# Altium schematic sheet Sheet1.SchDoc
size A4; DocumentNumber: 1; SheetNumber: 1; SheetTotal: 1
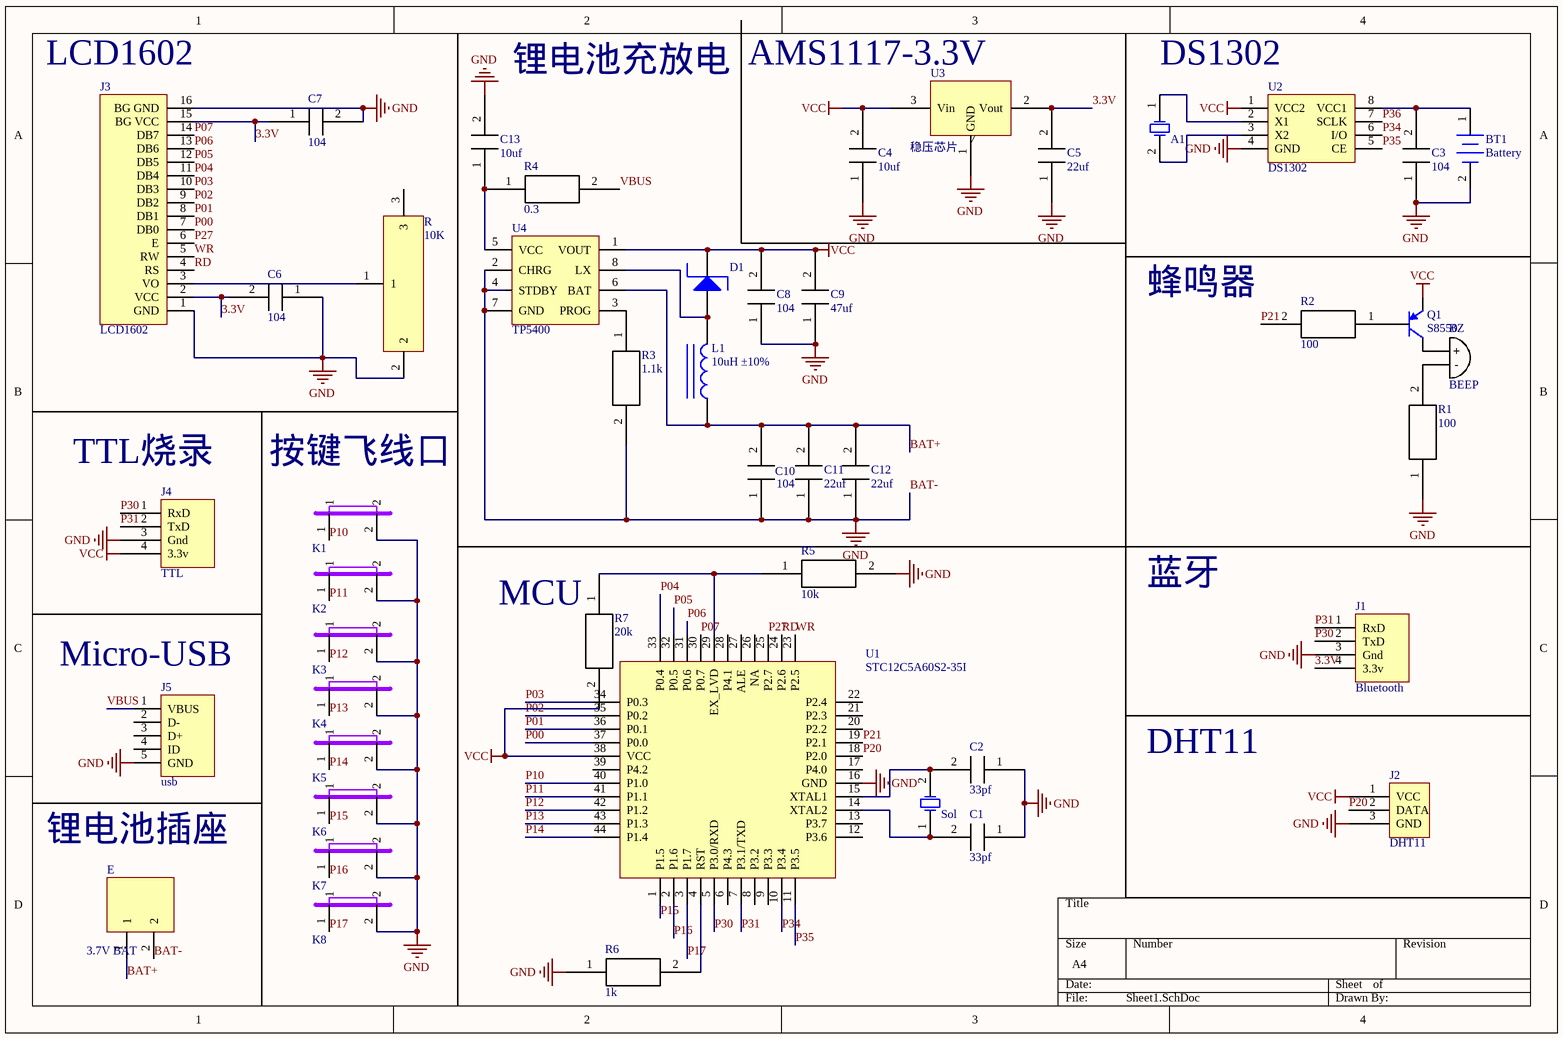
[diagram p0: Sheet1.SchDoc]

## Parts
A1  CrystalOscillator  [3*8圆柱晶振]  (value not drawn)
BT1  Battery  [CR1220_A]
BZ  BEEP  [BEEP 6.6x12x8.5]
C1  33pf  [C 0805_M]
C2  33pf  [C 0805_M]
C3  104  [C 0805_M]
C4  10uf  [C 0805_M]
C5  22uf  [C 0805_M]
C6  104  [C 0805_M]
C7  104  [C 0805_M]
C8  104  [C 0805_M]
C9  47uf  [C 0805_M]
C10  104  [C 0805_M]
C11  22uf  [C 0805_M]
C12  22uf  [C 0805_M]
C13  10uf  [C 0805_M]
D1  B5819W  SL  [SMB]  (value not drawn)
E  3.7V BAT  [XH2.54-LI-2P]
J1  Bluetooth  [HDR2.54-M-LI-4P]
J2  DHT11  [HDR2.54-M-LI-3P]
J3  LCD1602  [LCD-1602]
J4  TTL  [HDR2.54-LI-4P]
J5  usb  [USB-micro_C]
K1  key  [飞线口]  (value not drawn)
K2  key  [飞线口]  (value not drawn)
K3  key  [飞线口]  (value not drawn)
K4  key  [飞线口]  (value not drawn)
K5  key  [飞线口]  (value not drawn)
K6  key  [飞线口]  (value not drawn)
K7  key  [飞线口]  (value not drawn)
K8  key  [飞线口]  (value not drawn)
L1  10uH ±10%  [0805_L]
Q1  S8550  [SOT23]
R  10K  [可变电阻]
R1  100  [0805R]
R2  100  [0805R]
R3  1.1k  [0805R]
R4  0.3  [0805R]
R5  10k  [0805R]
R6  1k  [0805R]
R7  20k  [0805R]
Sol  CrystalOscillator  [OSC HC-49S]  (value not drawn)
U1  STC12C5A60S2-35I  [LQFP44-10*10]
U2  DS1302  [DIP8]
U3  稳压芯片  [SOT-223]
U4  TP5400  [SOP8]

## Nets
BAT-: BT1.2(-) C1.1 C2.1 C3.1 C4.1 C5.1 C6.1 C7.2 C8.1 C9.1 C10.1 C11.1 C12.1 C13.2 E.2 J1.3(Gnd) J2.3(GND) J3.1(GND) J3.16(BG_GND) J4.3(Gnd) J5.5(GND) K1.2 K2.2 K3.2 K4.2 K5.2 K6.2 K7.2 K8.2 R.2 R1.1 R3.2 R5.2 R6.1 U1.16(GND) U2.4(GND) U3.1(GND) U4.2(CHRG) U4.4(STDBY) U4.7(GND)  [also labelled GND]
VCC: C4.2 C8.2 C9.2 D1.2(K) J2.1(VCC) J4.4(3.3v) Q1.2(E) R7.2 U1.38(VCC) U2.1(VCC2) U3.3(Vin) U4.1(VOUT)
3.3V: C5.2 C6.2 C7.1 J1.4(3.3v) J3.2(VCC) J3.15(BG_VCC) U3.2(Vout)
BAT+: C10.2 C11.2 C12.2 E.1 L1.1 U4.6(BAT)
P00: J3.7(DB0) U1.37(P0.0)
P01: J3.8(DB1) U1.36(P0.1)
P02: J3.9(DB2) U1.35(P0.2)
P03: J3.10(DB3) U1.34(P0.3)
P04: J3.11(DB4) U1.33(P0.4)
P05: J3.12(DB5) U1.32(P0.5)
P06: J3.13(DB6) U1.31(P0.6)
P07: J3.14(DB7) U1.30(P0.7)
P10: K1.1 U1.40(P1.0)
P11: K2.1 U1.41(P1.1)
P12: K3.1 U1.42(P1.2)
P13: K4.1 U1.43(P1.3)
P14: K5.1 U1.44(P1.4)
P15: K6.1 U1.1(P1.5)
P16: K7.1 U1.2(P1.6)
P17: K8.1 U1.3(P1.7)
P20: J2.2(DATA) U1.18(P2.0)
P21: R2.2 U1.19(P2.1)
P27: J3.6(E) U1.25(P2.7)
P30: J1.2(TxD) J4.1(RxD) U1.5(P3.0/RXD)
P31: J1.1(RxD) J4.2(TxD) U1.7(P3.1/TXD)
P34: U1.10(P3.4) U2.6(I/O)
P35: U1.11(P3.5) U2.5(CE)
P36: U2.7(SCLK)
RD: J3.4(RS) U1.24(P2.6)
VBUS: J5.1(VBUS) R4.2
WR: J3.5(RW) U1.23(P2.5)
NetA1_1: A1.1(OSC1) U2.2(X1)
NetA1_2: A1.2(OSC2) U2.3(X2)
NetBT1_1: BT1.1(+) C3.2 U2.8(VCC1)
NetBZ_1: BZ.1(+) Q1.3(C)
NetBZ_2: BZ.2(-) R1.2
NetC1_2: C1.2 Sol.1(OSC1) U1.14(XTAL2)
NetC2_2: C2.2 Sol.2(OSC2) U1.15(XTAL1)
NetC13_1: C13.1 R4.1 U4.5(VCC)
NetD1_1: D1.1(A) L1.2 U4.8(LX)
NetJ3_3: J3.3(VO) R.1
NetQ1_1: Q1.1(B) R2.1
NetR3_1: R3.1 U4.3(PROG)
NetR5_1: R5.1 R7.1 U1.29(EX_LVD)
NetR6_2: R6.2 U1.4(RST)

Not connected (* = marked no-connect by the designer): J5 2(D-) 3(D+) 4(ID); R 3; U1 6(P4.3) 8(P3.2) 9(P3.3) 12(P3.6) 13(P3.7) 17(P4.0) 20(P2.2) 21(P2.3) 22(P2.4) 26(NA) 27(ALE) 28(P4.1) 39(P4.2)

## Notes on the sheet
- (near J3) LCD1602
- 锂电池充放电
- (near U3) AMS1117-3.3V
- DS1302
- 蜂鸣器
- (near J4) TTL烧录
- (near K1) 按键飞线口
- (near R7) MCU
- 蓝牙
- (near J5) Micro-USB
- DHT11
- 锂电池插座

## Library data of the parts
A1 Sol = XTAL: 晶振
BT1 = Battery: Multicell Battery; Published: 24-Mar-1999; LatestRevisionDate: 17-Jul-2002; LatestRevisionNote: Re-released for DXP Platform.; PackageReference: BAT-2; Publisher: Altium Limited; PackageDescription: Battery; 2 Leads
BZ = BEEP: 蜂鸣器
C1-C13 = 电容
D1 = SOD-123 B5819W  SL: 肖特基二极管; ComponentLink1Description: 供应商链接; ComponentLink1URL: http://www.szlcsc.com/product/details_9093.html; Package: SOD-123; Supplier: LC; SuppliersPartNumber: C8598
E = E: 电源
J1 J4 = BT06-B: 蓝牙
K1-K8 = key: 按键
L1 = 0805 10uH 10%: 贴片电感; ComponentLink1Description: 供应商链接; ComponentLink1URL: http://www.szlcsc.com/product/details_1398.html; Package: 0805; Supplier: LC; SuppliersPartNumber: C1046
Q1 = PNP S8550: Discrete PNP Bipolar Transistor; Published: 8-Jun-2000; Revision: July-2002: Re-released for DXP Platform.; Publisher: Altium Limited; Price(RMB): 0.000; PartNumber: S8550
R = 3296: 电位器
R1-R7 = 电阻
U1 = STC12C5A60S2-35I: MCU; ComponentLink1Description: 供应商链接; ComponentLink1URL: http://www.szlcsc.com/product/details_9202.html; Package: LQFP-44_10x10x08P; Supplier: LC; SuppliersPartNumber: C8696
U2 = DS1302: DS1302时钟芯片
U3 = AMS1117
U4 = TP5400: 电池管理芯片